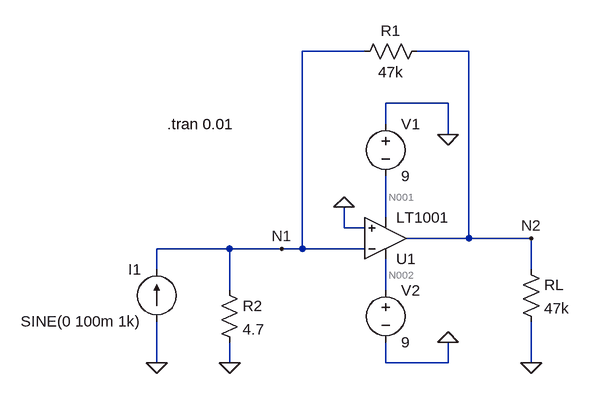
[diagram p0: schematic Op-Amp feedback (CCVS).asc]
Op-Amp feedback (CCVS).asc, the LTspice schematic file:
Version 4
SHEET 1 880 680
WIRE 144 -96 48 -96
WIRE 304 -96 224 -96
WIRE 272 -16 176 -16
WIRE 176 16 176 -16
WIRE 272 32 272 -16
WIRE 176 160 176 96
WIRE 112 176 112 144
WIRE 144 176 112 176
WIRE 304 192 304 -96
WIRE 304 192 208 192
WIRE 400 192 304 192
WIRE -64 208 -176 208
WIRE 16 208 -64 208
WIRE 48 208 48 -96
WIRE 48 208 16 208
WIRE 144 208 48 208
WIRE -176 240 -176 208
WIRE 400 240 400 192
WIRE -64 272 -64 208
WIRE 176 272 176 224
WIRE -176 384 -176 320
WIRE -64 384 -64 352
WIRE 176 384 176 352
WIRE 272 384 272 352
WIRE 272 384 176 384
WIRE 400 384 400 320
FLAG -64 384 0
FLAG -176 384 0
FLAG 272 32 0
FLAG 272 352 0
FLAG 400 384 0
FLAG 16 208 N1
FLAG 112 144 0
FLAG 400 192 N2
SYMBOL OpAmps\\LT1001 176 256 M180
SYMATTR InstName U1
SYMBOL current -176 320 R180
WINDOW 0 24 80 Left 2
WINDOW 3 24 0 Left 2
WINDOW 123 0 0 Left 0
WINDOW 39 0 0 Left 0
SYMATTR InstName I1
SYMATTR Value SINE(0 100m 1k)
SYMBOL res 240 -112 R90
WINDOW 0 0 56 VBottom 2
WINDOW 3 32 56 VTop 2
SYMATTR InstName R1
SYMATTR Value 47k
SYMBOL res -80 256 R0
SYMATTR InstName R2
SYMATTR Value 4.7
SYMBOL res 384 224 R0
SYMATTR InstName RL
SYMATTR Value 47k
SYMBOL voltage 176 0 R0
SYMATTR InstName V1
SYMATTR Value 9
SYMBOL voltage 176 256 R0
SYMATTR InstName V2
SYMATTR Value 9
TEXT -160 16 Left 2 !.tran 0.01

The netlist it stands for:
* Op-Amp feedback (CCVS).asc
XU1 0 N1 N002 N001 N2 LT1001  ; pins In+ In- V+ V- OUT
I1 0 N1 SINE(0 100m 1k)
R1 N2 N1 47k
R2 N1 0 4.7
RL N2 0 47k
V1 0 N001 9
V2 N002 0 9
.tran 0.01
.lib LTC.lib
.backanno
.end

* Results of the author's LTspice run, read from the files saved beside the schematic
* Operating Point, zero values left out:
*   V(n002) = 9 V
*   V(n001) = -9 V
*   I(V2) = -2.25 mA
*   I(V1) = -2.25 mA
*   Ix(u1:3) = 2.25 mA
*   Ix(u1:4) = -2.25 mA
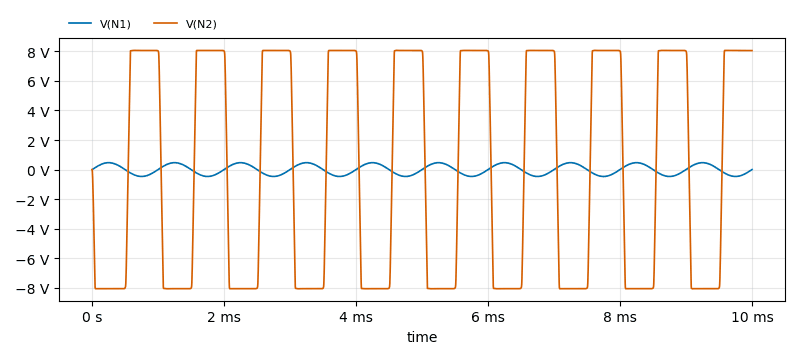
[diagram p1: Transient Analysis of Op-Amp feedback (CCVS).asc, plotted from the saved traces]
* Transient Analysis, 1 run:
*   V(N1): min -468.7 mV, max 468.7 mV, average -26.58 µV, rms 331.2 mV, last 805 µV
*   V(N2): min -8.067 V, max 8.066 V, average -54.79 mV, rms 7.701 V, last 8.051 V